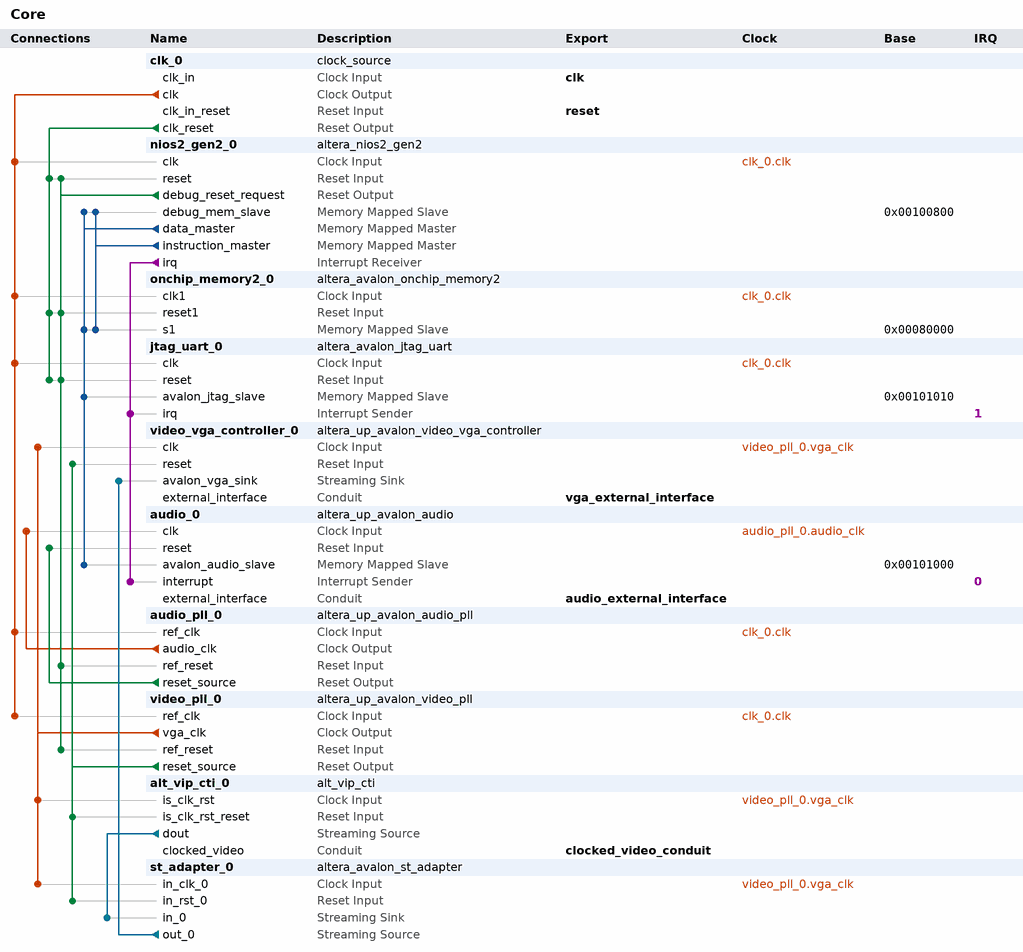
[diagram p0: system contents]
# Platform Designer (Qsys) system Core, Cyclone IV E EP4CE115F29C7
# Parameters at their usual value, and those the tool derives, are not listed.
package require -exact qsys 18.1
create_system Core
set_project_property DEVICE_FAMILY {Cyclone IV E}
set_project_property DEVICE EP4CE115F29C7

add_instance clk_0 clock_source 18.1
set_instance_parameter_value clk_0 clockFrequency 50000000

add_instance nios2_gen2_0 altera_nios2_gen2 18.1
set_instance_parameter_value nios2_gen2_0 dcache_size 2048
set_instance_parameter_value nios2_gen2_0 dividerType srt2
set_instance_parameter_value nios2_gen2_0 exceptionSlave onchip_memory2_0.s1
set_instance_parameter_value nios2_gen2_0 icache_size 4096
set_instance_parameter_value nios2_gen2_0 impl Fast
set_instance_parameter_value nios2_gen2_0 resetSlave onchip_memory2_0.s1

add_instance onchip_memory2_0 altera_avalon_onchip_memory2 18.1
set_instance_parameter_value onchip_memory2_0 dataWidth 8
set_instance_parameter_value onchip_memory2_0 dualPort false
set_instance_parameter_value onchip_memory2_0 initMemContent true
set_instance_parameter_value onchip_memory2_0 initializationFileName onchip_mem.hex
set_instance_parameter_value onchip_memory2_0 memorySize 400000

add_instance jtag_uart_0 altera_avalon_jtag_uart 18.1
set_instance_parameter_value jtag_uart_0 simInteractiveOptions NO_INTERACTIVE_WINDOWS

add_instance video_vga_controller_0 altera_up_avalon_video_vga_controller 18.0
set_instance_parameter_value video_vga_controller_0 board DE2-115
set_instance_parameter_value video_vga_controller_0 resolution {VGA 640x480}

add_instance audio_0 altera_up_avalon_audio 18.0
set_instance_parameter_value audio_0 audio_in true
set_instance_parameter_value audio_0 avalon_bus_type {Memory Mapped}
set_instance_parameter_value audio_0 dw 16

add_instance audio_pll_0 altera_up_avalon_audio_pll 18.0
set_instance_parameter_value audio_pll_0 gui_refclk 50.0

add_instance video_pll_0 altera_up_avalon_video_pll 18.0
set_instance_parameter_value video_pll_0 camera {5MP Digital Camera (THDB_D5M)}
set_instance_parameter_value video_pll_0 gui_refclk 50.0
set_instance_parameter_value video_pll_0 lcd {7" LCD on VEEK-MT and MTL/MTL2 Modules}

add_instance alt_vip_cti_0 alt_vip_cti 14.0
set_instance_parameter_value alt_vip_cti_0 ACCEPT_COLOURS_IN_SEQ 0
set_instance_parameter_value alt_vip_cti_0 ADD_DATA_ENABLE_SIGNAL 0
set_instance_parameter_value alt_vip_cti_0 BPS 10
set_instance_parameter_value alt_vip_cti_0 CLOCKS_ARE_SAME 0
set_instance_parameter_value alt_vip_cti_0 COLOUR_PLANES_ARE_IN_PARALLEL 1
set_instance_parameter_value alt_vip_cti_0 FAMILY {Cyclone IV E}
set_instance_parameter_value alt_vip_cti_0 FIFO_DEPTH 640
set_instance_parameter_value alt_vip_cti_0 GENERATE_ANC 0
set_instance_parameter_value alt_vip_cti_0 GENERATE_SYNC 0
set_instance_parameter_value alt_vip_cti_0 H_ACTIVE_PIXELS_F0 640
set_instance_parameter_value alt_vip_cti_0 INTERLACED 0
set_instance_parameter_value alt_vip_cti_0 NUMBER_OF_COLOUR_PLANES 3
set_instance_parameter_value alt_vip_cti_0 STD_WIDTH 1
set_instance_parameter_value alt_vip_cti_0 SYNC_TO 0
set_instance_parameter_value alt_vip_cti_0 USE_CONTROL 0
set_instance_parameter_value alt_vip_cti_0 USE_EMBEDDED_SYNCS 1
set_instance_parameter_value alt_vip_cti_0 USE_STD 0
set_instance_parameter_value alt_vip_cti_0 V_ACTIVE_LINES_F0 480
set_instance_parameter_value alt_vip_cti_0 V_ACTIVE_LINES_F1 480

add_instance st_adapter_0 altera_avalon_st_adapter 18.1
set_instance_parameter_value st_adapter_0 inBitsPerSymbol 10
set_instance_parameter_value st_adapter_0 inChannelWidth 0
set_instance_parameter_value st_adapter_0 inDataWidth 30
set_instance_parameter_value st_adapter_0 inErrorWidth 0
set_instance_parameter_value st_adapter_0 inMaxChannel 0
set_instance_parameter_value st_adapter_0 inReadyLatency 1
set_instance_parameter_value st_adapter_0 inUseEmptyPort 0
set_instance_parameter_value st_adapter_0 inUsePackets 1
set_instance_parameter_value st_adapter_0 inUseReady 1
set_instance_parameter_value st_adapter_0 inUseValid 1
set_instance_parameter_value st_adapter_0 outChannelWidth 0
set_instance_parameter_value st_adapter_0 outDataWidth 30
set_instance_parameter_value st_adapter_0 outErrorWidth 0
set_instance_parameter_value st_adapter_0 outMaxChannel 0
set_instance_parameter_value st_adapter_0 outReadyLatency 0
set_instance_parameter_value st_adapter_0 outUseEmptyPort 0
set_instance_parameter_value st_adapter_0 outUseReady 1
set_instance_parameter_value st_adapter_0 outUseValid 1

# connections
add_connection audio_pll_0.audio_clk audio_0.clk clock
add_connection clk_0.clk audio_pll_0.ref_clk clock
add_connection clk_0.clk jtag_uart_0.clk clock
add_connection clk_0.clk nios2_gen2_0.clk clock
add_connection clk_0.clk onchip_memory2_0.clk1 clock
add_connection clk_0.clk video_pll_0.ref_clk clock
add_connection video_pll_0.vga_clk alt_vip_cti_0.is_clk_rst clock
add_connection video_pll_0.vga_clk st_adapter_0.in_clk_0 clock
add_connection video_pll_0.vga_clk video_vga_controller_0.clk clock
add_connection audio_pll_0.reset_source audio_0.reset reset
add_connection clk_0.clk_reset jtag_uart_0.reset reset
add_connection clk_0.clk_reset nios2_gen2_0.reset reset
add_connection clk_0.clk_reset onchip_memory2_0.reset1 reset
add_connection nios2_gen2_0.debug_reset_request audio_pll_0.ref_reset reset
add_connection nios2_gen2_0.debug_reset_request jtag_uart_0.reset reset
add_connection nios2_gen2_0.debug_reset_request nios2_gen2_0.reset reset
add_connection nios2_gen2_0.debug_reset_request onchip_memory2_0.reset1 reset
add_connection nios2_gen2_0.debug_reset_request video_pll_0.ref_reset reset
add_connection video_pll_0.reset_source alt_vip_cti_0.is_clk_rst_reset reset
add_connection video_pll_0.reset_source st_adapter_0.in_rst_0 reset
add_connection video_pll_0.reset_source video_vga_controller_0.reset reset
add_connection nios2_gen2_0.data_master audio_0.avalon_audio_slave avalon
set_connection_parameter_value nios2_gen2_0.data_master/audio_0.avalon_audio_slave baseAddress 0x00101000
add_connection nios2_gen2_0.data_master jtag_uart_0.avalon_jtag_slave avalon
set_connection_parameter_value nios2_gen2_0.data_master/jtag_uart_0.avalon_jtag_slave baseAddress 0x00101010
add_connection nios2_gen2_0.data_master nios2_gen2_0.debug_mem_slave avalon
set_connection_parameter_value nios2_gen2_0.data_master/nios2_gen2_0.debug_mem_slave baseAddress 0x00100800
add_connection nios2_gen2_0.data_master onchip_memory2_0.s1 avalon
set_connection_parameter_value nios2_gen2_0.data_master/onchip_memory2_0.s1 baseAddress 0x00080000
add_connection nios2_gen2_0.instruction_master nios2_gen2_0.debug_mem_slave avalon
set_connection_parameter_value nios2_gen2_0.instruction_master/nios2_gen2_0.debug_mem_slave baseAddress 0x00100800
add_connection nios2_gen2_0.instruction_master onchip_memory2_0.s1 avalon
set_connection_parameter_value nios2_gen2_0.instruction_master/onchip_memory2_0.s1 baseAddress 0x00080000
add_connection alt_vip_cti_0.dout st_adapter_0.in_0 avalon_streaming
add_connection st_adapter_0.out_0 video_vga_controller_0.avalon_vga_sink avalon_streaming
add_connection nios2_gen2_0.irq audio_0.interrupt interrupt
set_connection_parameter_value nios2_gen2_0.irq/audio_0.interrupt irqNumber 0
add_connection nios2_gen2_0.irq jtag_uart_0.irq interrupt
set_connection_parameter_value nios2_gen2_0.irq/jtag_uart_0.irq irqNumber 1

# exported interfaces
add_interface audio_external_interface conduit end
set_interface_property audio_external_interface EXPORT_OF audio_0.external_interface
add_interface clk clock sink
set_interface_property clk EXPORT_OF clk_0.clk_in
add_interface clocked_video_conduit conduit end
set_interface_property clocked_video_conduit EXPORT_OF alt_vip_cti_0.clocked_video
add_interface reset reset sink
set_interface_property reset EXPORT_OF clk_0.clk_in_reset
add_interface vga_external_interface conduit end
set_interface_property vga_external_interface EXPORT_OF video_vga_controller_0.external_interface

set_interconnect_requirement {$system} qsys_mm.clockCrossingAdapter HANDSHAKE
set_interconnect_requirement {$system} qsys_mm.enableEccProtection FALSE
set_interconnect_requirement {$system} qsys_mm.insertDefaultSlave FALSE
set_interconnect_requirement {$system} qsys_mm.maxAdditionalLatency 1

save_system Core.qsys
